# EAGLE design Open_IR_Blaster (EAGLE 9.7.0)
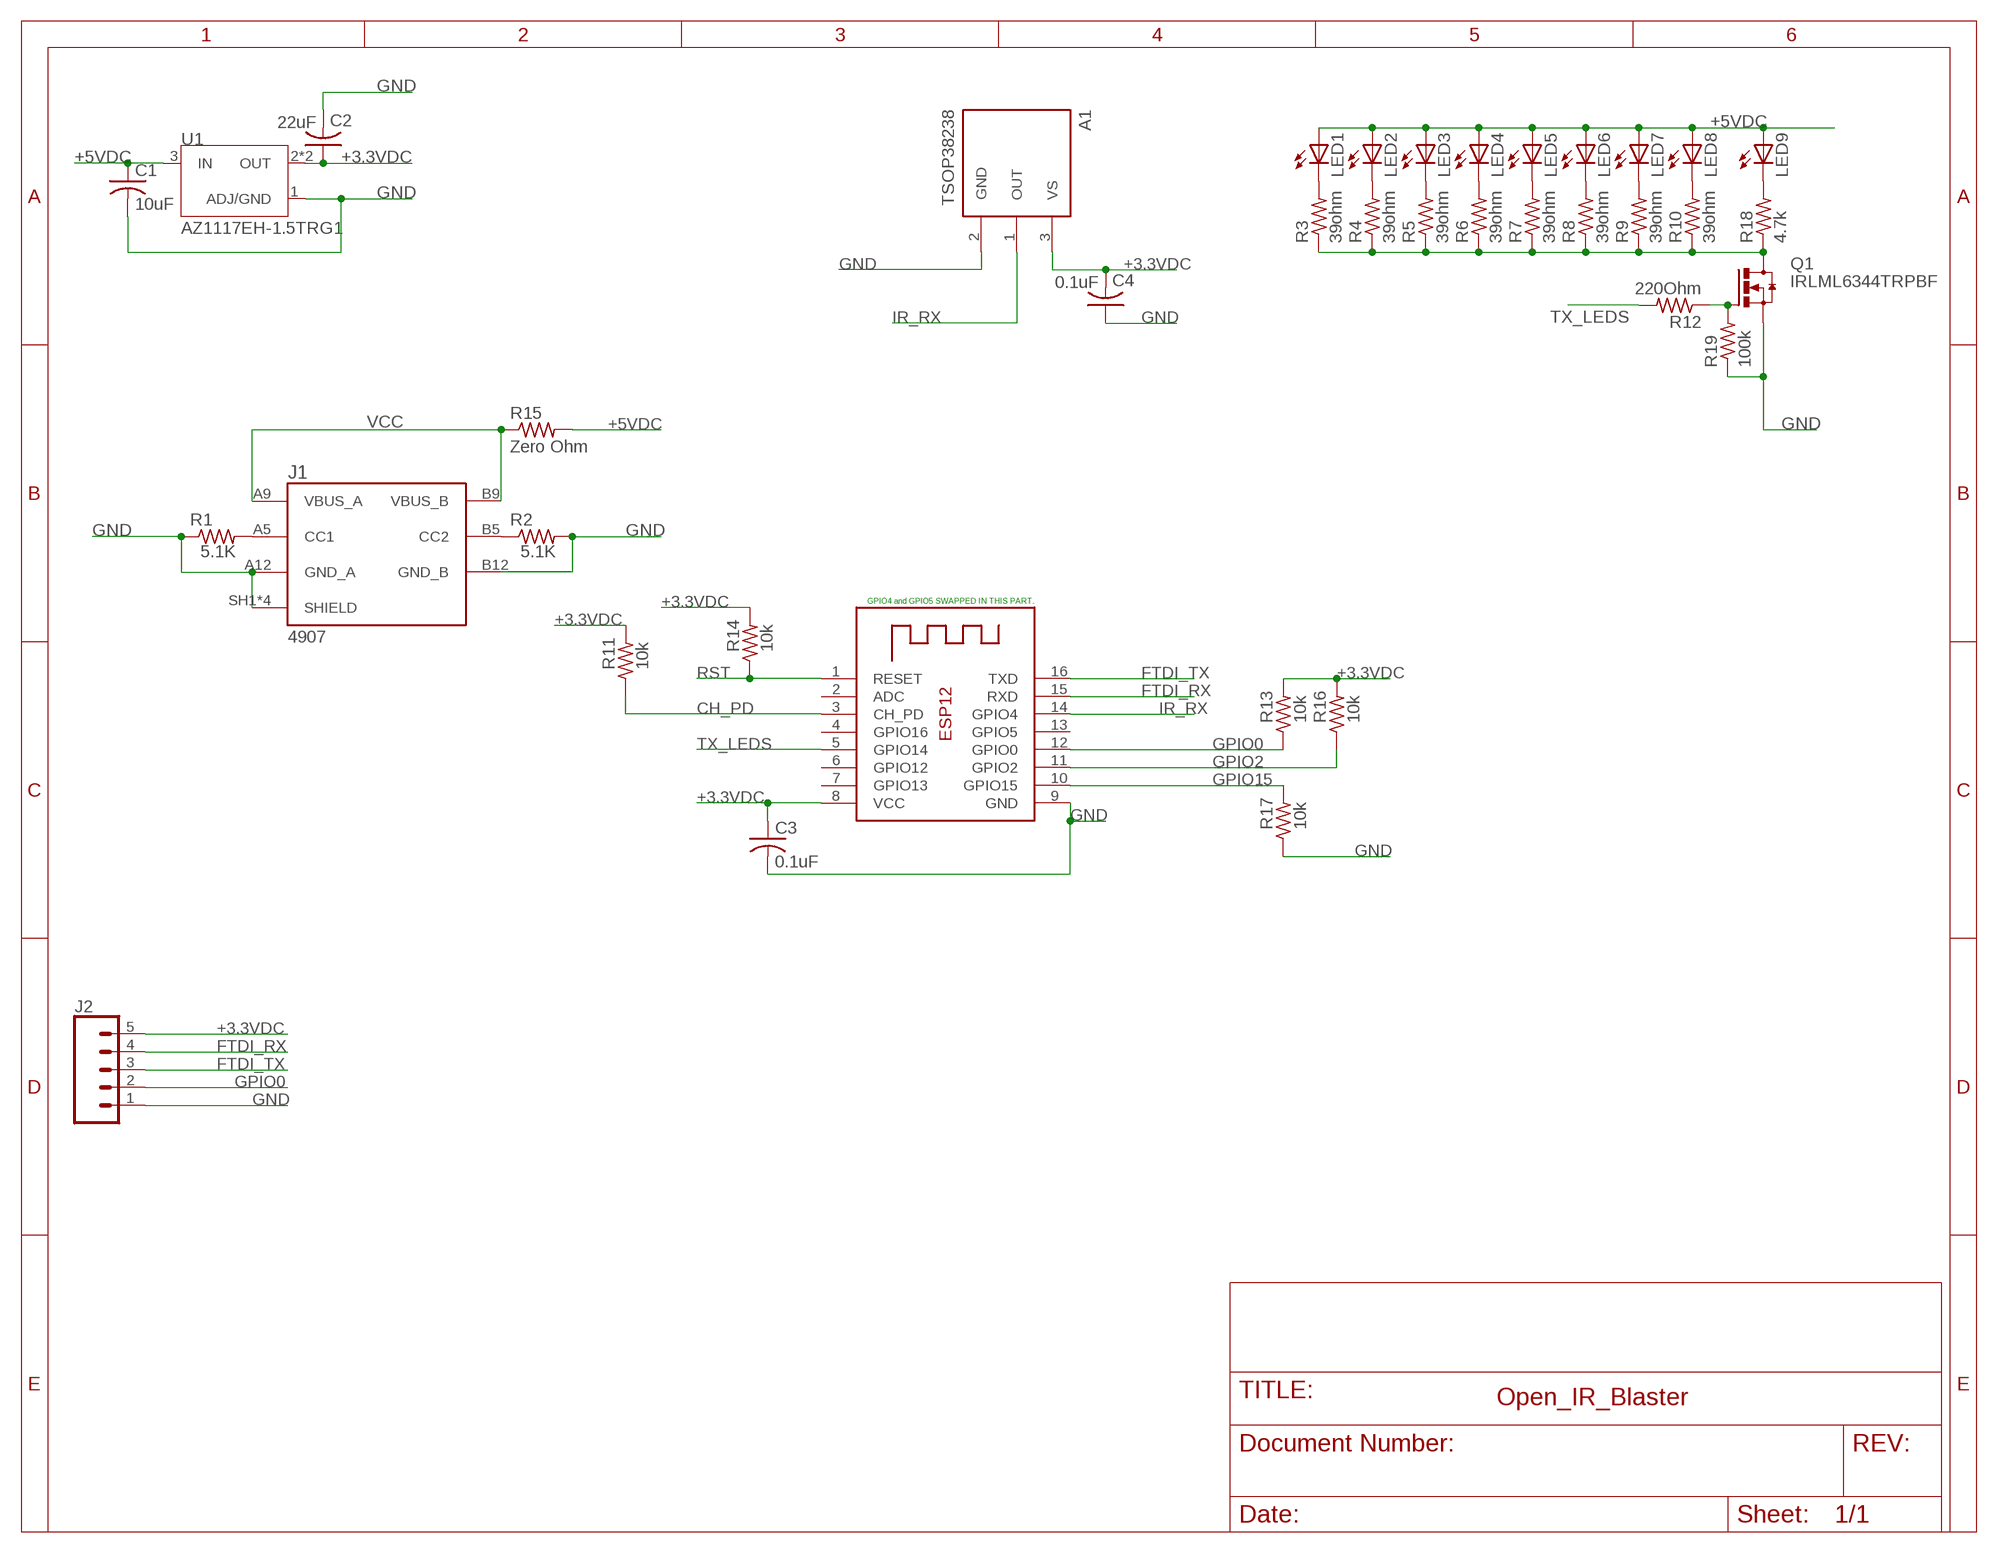
[diagram p0: schematic, sheet 1]

## Parts
A1  TSOP38238  [XDCR_TSOP38238]
C1  10uF  C-USC0805  [C0805]
C2  22uF  C-USC0805  [C0805]
C3  0.1uF  C-USC0805  [C0805]
C4  0.1uF  C-USC0805  [C0805]
J1  4907  [ADAFRUIT_4907]
J2  CONN_05PTH_LONGPADS  [1X05_LONGPADS]
LED1  LED5MM  [LED5MM]
LED2  LED5MM  [LED5MM]
LED3  LED5MM  [LED5MM]
LED4  LED5MM  [LED5MM]
LED5  LED5MM  [LED5MM]
LED6  LED5MM  [LED5MM]
LED7  LED5MM  [LED5MM]
LED8  LED5MM  [LED5MM]
LED9  LEDCHIP-LED0603  [CHIP-LED0603]
Q1  IRLML6344TRPBF  [SOT23]
R1  5.1K  R-US_M0805  [M0805]
R2  5.1K  R-US_M0805  [M0805]
R3  39ohm  R-US_R1210  [R1210]
R4  39ohm  R-US_R1210  [R1210]
R5  39ohm  R-US_R1210  [R1210]
R6  39ohm  R-US_R1210  [R1210]
R7  39ohm  R-US_R1210  [R1210]
R8  39ohm  R-US_R1210  [R1210]
R9  39ohm  R-US_R1210  [R1210]
R10  39ohm  R-US_R1210  [R1210]
R11  10k  R-US_M0805  [M0805]
R12  220Ohm  R-US_M0805  [M0805]
R13  10k  R-US_M0805  [M0805]
R14  10k  R-US_M0805  [M0805]
R15  Zero Ohm  R-US_R1210  [R1210]
R16  10k  R-US_M0805  [M0805]
R17  10k  R-US_M0805  [M0805]
R18  4.7k  R-US_R0603  [R0603]
R19  100k  R-US_R0603  [R0603]
U1  AZ1117EH-1.5TRG1  [SOT230P700X180-4N]
X1  ESP-12  [ESP-12]

## Nets
+3.3VDC: A1.3(VS) C2.1 C3.1 C4.2 J2.5 R11.2 R13.2 R14.2 R16.2 U1.2(OUT) U1.4(OUT) X1.8(VCC)
+5VDC: C1.1 LED1.A LED2.A LED3.A LED4.A LED5.A LED6.A LED7.A LED8.A LED9.A R15.2 U1.3(IN)
CH_PD: R11.1 X1.3(CH_PD)
FTDI_RX: J2.4 X1.15(RXD)
FTDI_TX: J2.3 X1.16(TXD)
GND: A1.2(GND) C1.2 C2.2 C3.2 C4.1 J1.A12(GND_A) J1.B12(GND_B) J1.SH1(SHIELD) J1.SH2(SHIELD) J1.SH3(SHIELD) J1.SH4(SHIELD) J2.1 Q1.2(S) R1.1 R2.2 R17.1 R19.1 U1.1(ADJ/GND) X1.9(GND)
GPIO0: J2.2 R13.1 X1.12(GPIO0)
GPIO2: R16.1 X1.11(GPIO2)
GPIO15: R17.2 X1.10(GPIO15)
IR_RX: A1.1(OUT) X1.14(GPIO4)
N$1: LED1.K(C) R3.2
N$2: LED2.K(C) R4.2
N$3: LED3.K(C) R5.2
N$4: LED4.K(C) R6.2
N$5: LED5.K(C) R7.2
N$6: LED6.K(C) R8.2
N$7: LED7.K(C) R9.2
N$8: LED8.K(C) R10.2
N$9: Q1.3(D) R3.1 R4.1 R5.1 R6.1 R7.1 R8.1 R9.1 R10.1 R18.1
N$10: J1.A5(CC1) R1.2
N$11: J1.B5(CC2) R2.1
N$12: Q1.1(G) R12.1 R19.2
N$13: LED9.C R18.2
RST: R14.1 X1.1(RESET)
TX_LEDS: R12.2 X1.5(GPIO14)
VCC: J1.A9(VBUS_A) J1.B9(VBUS_B) R15.1
Unconnected: X1.2(ADC) X1.4(GPIO16) X1.6(GPIO12) X1.7(GPIO13) X1.13(GPIO5)

## Notes on the sheet
- GPIO4 and GPIO5 SWAPPED IN THIS PART.

## Library data of the parts
A1 = TSOP38238:TSOP38238: Remote Receiver Sensor, 38.0kHz 45m; CHECK_PRICES: https://www.snapeda.com/parts/TSOP38238/Vishay+Semiconductor+Opto+Division/view-part/?ref=eda; DESCRIPTION: Remote Receiver Sensor 38.0kHz 45m Through Hole; DIGIKEY_PART_NUMBER: 751-1227-ND; MF: Vishay; MP: TSOP38238; PACKAGE: None; SNAPEDA_LINK: https://www.snapeda.com/parts/TSOP38238/Vishay+Semiconductor+Opto+Division/view-part/?ref=snap
C1-C4 = adafruit:C-US: CAPACITOR, American symbol
J1 = 4907:4907: Check availability <https://pricing.snapeda.com/parts/4907/Adafruit%20Industries%20LLC/view-part?ref=eda>; AVAILABILITY: Not in stock; CHECK_PRICES: https://www.snapeda.com/parts/4907/Adafruit+Industries/view-part/?ref=eda; DESCRIPTION: USB Connectors USB C SMT / THM Jack Connector - Power Only - Pack of 10; MF: Adafruit Industries LLC; MP: 4907; PACKAGE: NON-STANDARD-64 ADAFRUIT; PRICE: None; SNAPEDA_LINK: https://www.snapeda.com/parts/4907/Adafruit+Industries/view-part/?ref=snap
J2 = SparkFun-Connectors:CONN_05: Multi connection point. Often used as Generic Header-pin footprint for 0.1 inch spaced/style header connections On any of the 0.1 inch spaced packages, you can populate with these: Break Away Headers - Straight <https://www.sparkfun.com/products/116> (PRT-00116) Break Away Male Headers - Right Angle <https://www.sparkfun.com/products/553> (PRT-00553) Female Headers <https://www.sparkfun.com/products/115> (PRT-00115) Break Away Headers - Machine Pin <https://www.sparkfun.com/products/117> (PRT-00117) Break Away Female Headers - Swiss Machine Pin <https://www.sparkfun.com/products/743> (PRT-00743) For SCREWTERMINALS and SPRING TERMINALS visit here: Screw Terimnals on SparkFun.com <https://www.sparkfun.com/search/results?term=Screw+Terminals> (5mm/3.5mm/2.54mm spacing) This device is also useful as a general connection point to wire up your design to another part of your project. Our various solder wires solder well into these plated through hole pads. Hook-Up Wire - Assortment (Stranded, 22 AWG) <https://www.sparkfun.com/products/11375> (PRT-11375) Hook-Up Wire - Assortment (Solid Core, 22 AWG) <https://www.sparkfun.com/products/11367> (PRT-11367) View the entire wire category on our website here <https://www.sparkfun.com/categories/141> Special notes: Molex polarized connector foot print use with SKU : PRT-08231 with associated crimp pins and housings. 1MM SMD Version SKU: PRT-10208
LED1-LED9 = adafruit:LED: LED OSRAM: - CHIPLED LG R971, LG N971, LY N971, LG Q971, LY Q971, LO R971, LY R971 LH N974, LH R974 LS Q976, LO Q976, LY Q976 LO Q996 - Hyper CHIPLED LW Q18S LB Q993, LB Q99A, LB R99A - SideLED LS A670, LO A670, LY A670, LG A670, LP A670 LB A673, LV A673, LT A673, LW A673 LH A674 LY A675 LS A676, LA A676, LO A676, LY A676, LW A676 LS A679, LY A679, LG A679 - Hyper Micro SIDELED® LS Y876, LA Y876, LO Y876, LY Y876 LT Y87S - SmartLED LW L88C, LW L88S LB L89C, LB L89S, LG L890 LS L89K, LO L89K, LY L89K LS L896, LA L896, LO L896, LY L896 - TOPLED LS T670, LO T670, LY T670, LG T670, LP T670 LSG T670, LSP T670, LSY T670, LOP T670, LYG T670 LG T671, LOG T671, LSG T671 LB T673, LV T673, LT T673, LW T673 LH T674 LS T676, LA T676, LO T676, LY T676, LB T676, LH T676, LSB T676, LW T676 LB T67C, LV T67C, LT T67C, LS T67K, LO T67K, LY T67K, LW E67C LS E67B, LA E67B, LO E67B, LY E67B, LB E67C, LV E67C, LT E67C LW T67C LS T679, LY T679, LG T679 LS T770, LO T770, LY T770, LG T770, LP T770 LB T773, LV T773, LT T773, LW T773 LH T774 LS E675, LA E675, LY E675, LS T675 LS T776, LA T776, LO T776, LY T776, LB T776 LHGB T686 LT T68C, LB T68C - Hyper Mini TOPLED® LB M676 - Mini TOPLED Santana® LG M470 LS M47K, LO M47K, LY M47K Source: http://www.osram.convergy.de/
Q1 = IRLML6344TRPBF:IRLML6344TRPBF: Transistor NMOS 30V 6.3A, 29mOhm@4.5V; CHECK_PRICES: https://www.snapeda.com/parts/IRLML6344TRPBF/Infineon/view-part/?ref=eda; DESCRIPTION: IRLML6344TRPBF N-channel MOSFET Transistor, 5 A, 30 V, 3-Pin SOT-23 | Infineon IRLML6344TRPBF; DIGIKEY_PART_NUMBER: IRLML6344TRPBFTR-ND; MF: Infineon Technologies; MP: IRLML6344TRPBF; PACKAGE: SOT-23-3 ON Semiconductor; SNAPEDA_LINK: https://www.snapeda.com/parts/IRLML6344TRPBF/Infineon/view-part/?ref=snap
R1-R19 = adafruit:R-US_: RESISTOR, American symbol
U1 = AZ1117EH-1.5TRG1:AZ1117EH-1.5TRG1: Ldo.Vreg Pos 3, 3v 1a Sot223 Check availability <https://pricing.snapeda.com/parts/AZ1117EH-1.5TRG1/Diodes%20Inc./view-part?ref=eda>; AVAILABILITY: In Stock; CHECK_PRICES: https://www.snapeda.com/parts/AZ1117EH-1.5TRG1/Diodes+Inc./view-part/?ref=eda; DESCRIPTION: Linear Voltage Regulator IC Positive Fixed 1 Output 1A SOT-223-3; MF: Diodes Inc.; MP: AZ1117EH-1.5TRG1; PACKAGE: SOT-223 Diodes Inc.; PRICE: None; SNAPEDA_LINK: https://www.snapeda.com/parts/AZ1117EH-1.5TRG1/Diodes+Inc./view-part/?ref=snap
X1 = adafruit:ESP-12

## Board
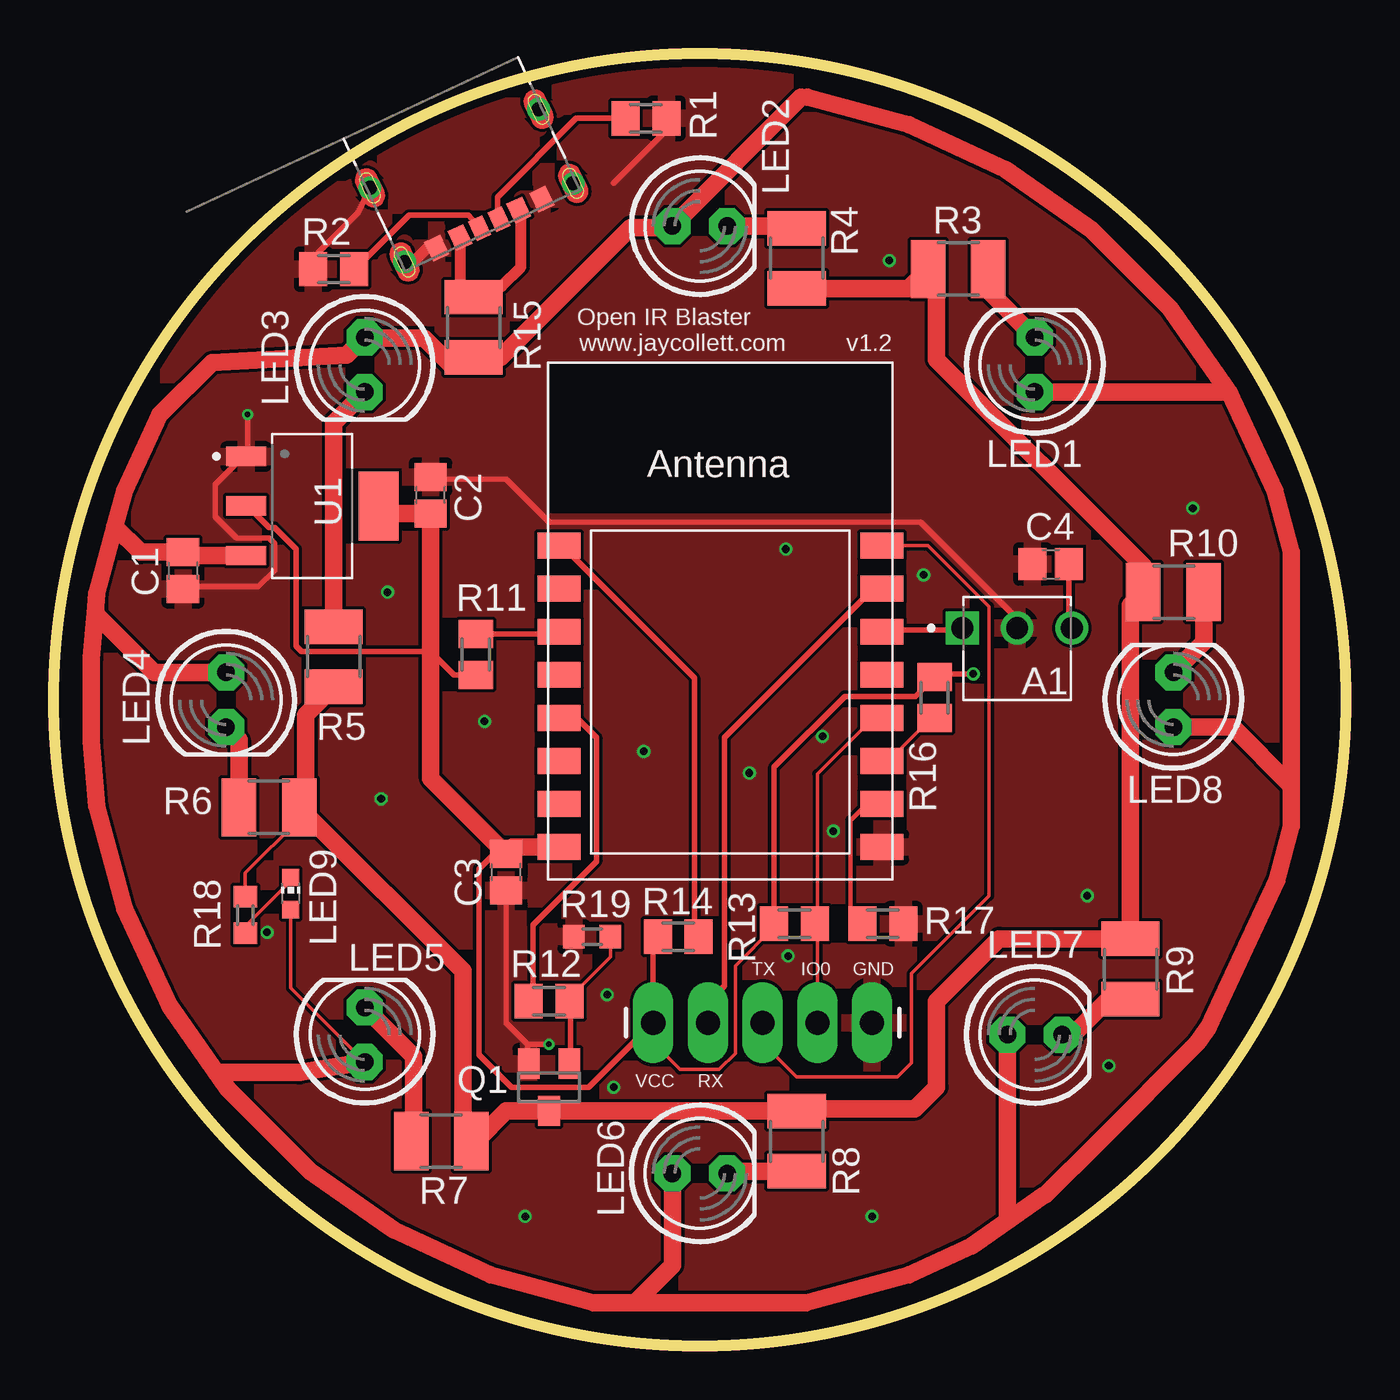
[diagram p1: board, top side]
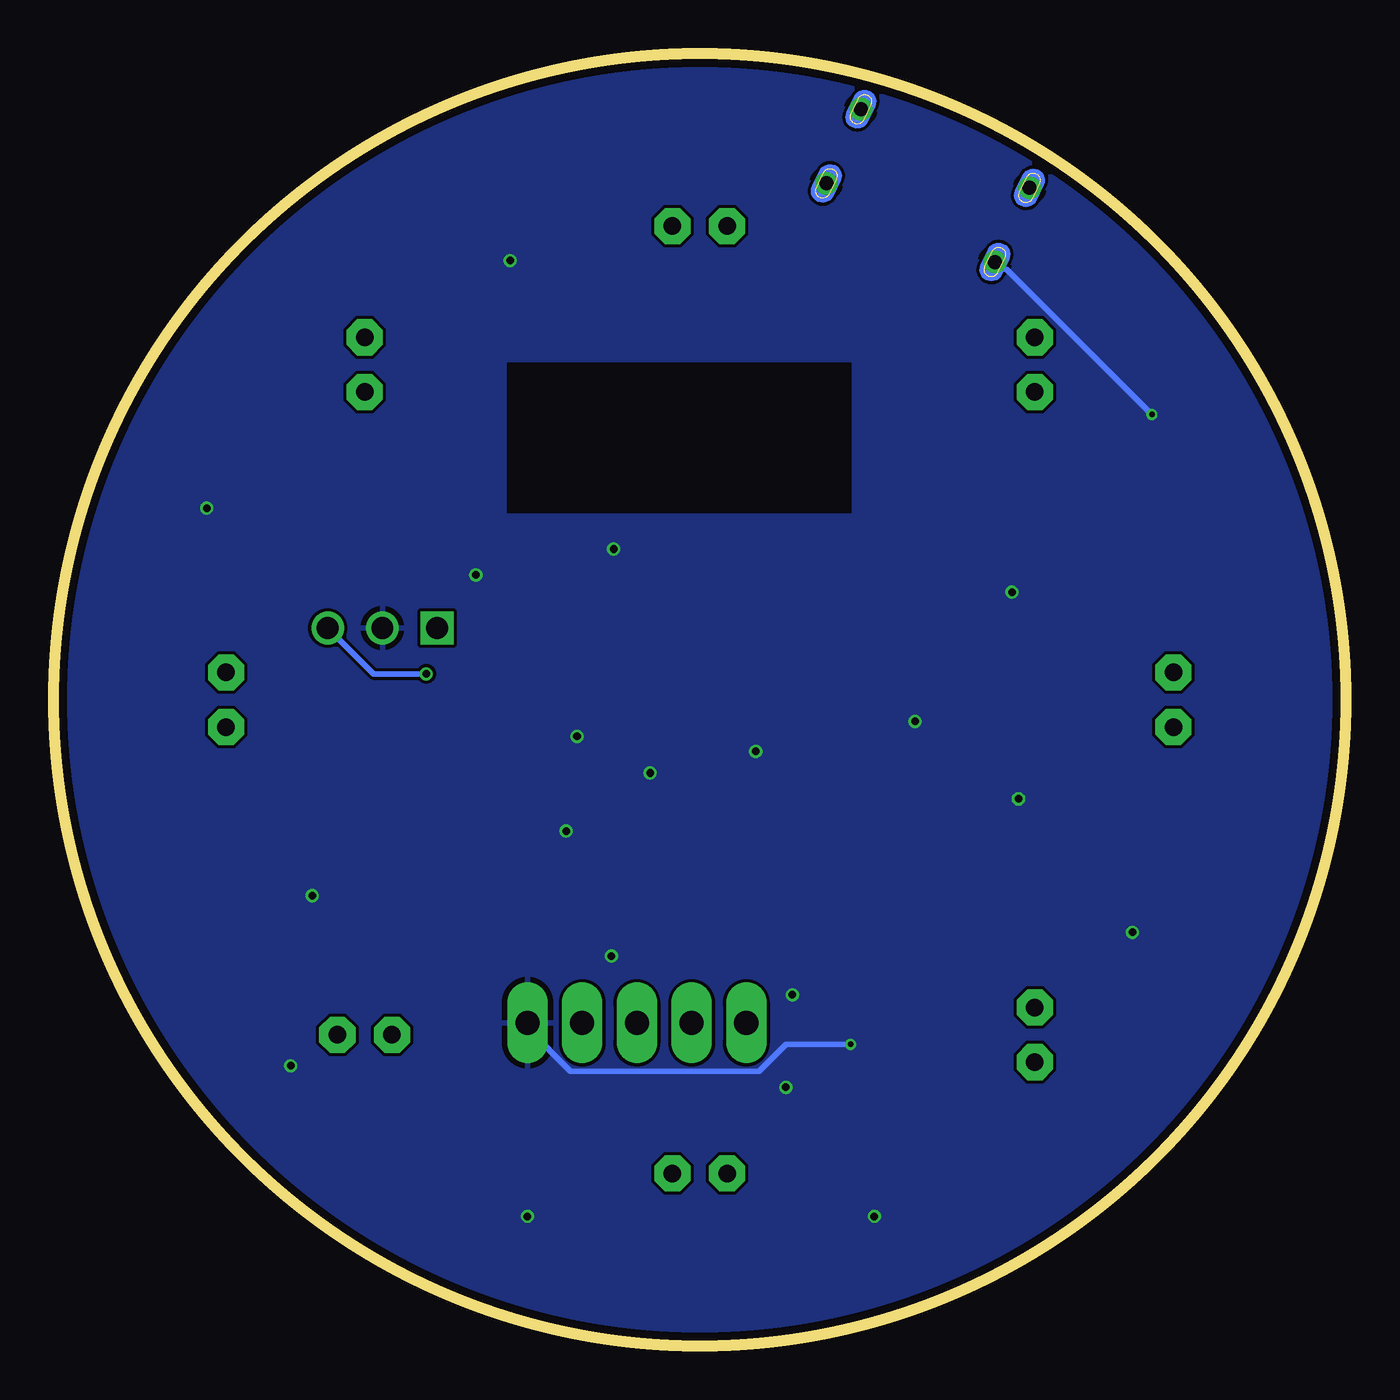
[diagram p2: board, bottom side, seen from below]

Size 60 x 60 mm. Coordinates in mm from the lower left corner, seen from the top.
Outline: circle at 30,30 radius 30
Copper layers (1*16): Top 0.035559375mm / dielectric 1.6mm / Bottom 0.035559375mm
Design rules "oshpark-2layer *": minimum track width 6mil, minimum drill 10mil, track to track 6mil, track to pad 6mil, pad to pad 6mil, via to via 6mil, smd to smd 6mil, copper to edge 15mil, drill to drill 6mil, minimum pad ring 5mil, minimum via ring 5mil, stop-mask expansion 2.5mil, vias tented up to drill 30mil, thermal gap 10mil

### Footprints (pad centres in the part's own frame; a part is rotated, then mirrored left to right if it is on the bottom)
XDCR_TSOP38238 = drill 1.01 square: 1 -2.54,0 | drill 1.01: 2 0,0; 3 2.54,0
C0805 = smd 1.3 x 1.5: 1 -0.85,0; 2 0.85,0
ADAFRUIT_4907 = smd 0.7 x 1: A5 -0.5,3.85; B5 0.5,3.85 | smd 0.8 x 1: A9 1.5,3.85; A12 2.7,3.85; B9 -1.5,3.85; B12 -2.7,3.85 | drill 0.65 pad 1.05: SH1 -4.32,3.8; SH2 4.32,3.8; SH3 -4.32,0; SH4 4.32,0
1X05_LONGPADS = drill 1.118 pad 1.88 long: 1 0,0; 2 2.54,0; 3 5.08,0; 4 7.62,0; 5 10.16,0
LED5MM = drill 0.813 pad 1.676 octagon: A -1.27,0; K 1.27,0
CHIP-LED0603 = smd 0.8 x 0.8: A 0,-0.75; C 0,0.75
SOT23 = smd 1 x 1.4: 1 -0.95,-1.1; 2 0.95,-1.1; 3 0,1.1
M0805 = smd 1.3 x 1.6: 1 -0.95,0; 2 0.95,0
R1210 = smd 1.6 x 2.7: 1 -1.4,0; 2 1.4,0
R0603 = smd 1 x 1.1: 1 -0.85,0; 2 0.85,0
SOT230P700X180-4N = smd 1.86 x 0.9: 1 -3.075,2.3; 2 -3.075,0; 3 -3.075,-2.3 | smd 1.86 x 3.19: 4 3.075,0
ESP-12 = smd 2 x 1.2: 1 -7.5,4.5; 2 -7.5,2.5; 3 -7.5,0.5; 4 -7.5,-1.5; 5 -7.5,-3.5; 6 -7.5,-5.5; 7 -7.5,-7.5; 8 -7.5,-9.5; 9 7.5,-9.5; 10 7.5,-7.5; 11 7.5,-5.5; 12 7.5,-3.5; 13 7.5,-1.5; 14 7.5,0.5; 15 7.5,2.5; 16 7.5,4.5

### Placement (x,y rotation side)
A1  44.74,33.33 0 top
C1  6,36 270 top
C2  17.5,39.5 90 top
C3  21,22 270 top
C4  46.3,36.3 0 top
J1  18.6,55.6 205 top
J2  38,15 180 top
LED1  45.56,45.56 90 top
LED2  30,52 0 top
LED3  14.44,45.56 270 top
LED4  8,30 270 top
LED5  14.44,14.44 90 top
LED6  30,8 0 top
LED7  45.56,14.44 0 top
LED8  52,30 90 top
LED9  11,21 0 top
Q1  23,12 180 top
R1  27.5,57 180 top
R2  13,50 180 top
R3  42,50 0 top
R4  34.5,50.5 90 top
R5  13,32 90 top
R6  10,25 180 top
R7  18,9.5 180 top
R8  34.5,9.5 270 top
R9  50,17.5 270 top
R10  52,35 0 top
R11  19.6,32.1 270 top
R12  23,16 180 top
R13  34.4,19.6 180 top
R14  29,19 180 top
R15  19.5,47.3 270 top
R16  40.9,30.1 90 top
R17  38.5,19.6 180 top
R18  8.9,20 270 top
R19  25,19 0 top
U1  12,39 0 top
X1  30.96,32.66 0 top

### Tracks (layer width: path | path; a pad name or v marks a point on that pad's centre or on a via)
+3.3VDC  (via drill 0.35)
  Top 0.152: R13.2 33.45,19.45 31.65,17.65 31.65,13.58 30.9,12.82 29.08,12.82 27.84,14.06 J2.5
  Top 0.254: R11.2 18.6,31.15 17.5,32.25 11.5,32.25 11.25,32.5 11.25,37 10.25,38 10,38 9,39 U1.2 | C4.2 47.15,33.46 A1.3 | v42.7,31.2 41.05,31.2 R16.2 40.01,30.16 36.74,30.16 33.45,26.87 R13.2 | C3.1 20.58,22.98 19.75,22.15 19.75,13.5 21.25,12 24.84,12 J2.5 27.84,18.79 R14.2
  Top 0.813: X1.8 21.31,23.16 C3.1 17.5,26.35 17.5,32.25 C2.1 15.43,38.65 U1.4
  Bottom 0.254: A1.3 45.15,31.2 v42.7,31.2
+5VDC
  Top 0.152: LED9.A 11,16.61 LED5.A
  Top 0.508: 18.4,45.6 18.7,45.9 R15.2 20.76,45.9
  Top 0.61: 28.3,51.94 28.36,52 LED2.A | 34.71,57.98 34.99,57.98 | 34.94,2 34.91,2 | 25.09,2 25.06,2 | 46.05,7 46,7 | 54.55,44.29 54.62,44.22 | 6.15,36.7 C1.1
  Top 0.813: LED2.A 34.71,57.98 | 34.99,57.98 39.72,56.72 44.22,54.62 48.19,51.84 51.84,48.19 54.62,44.22 56.72,39.72 57.48,36.86 57.48,26 | 57.48,26 57.48,24.14 56.81,21.62 53.62,14.79 53.11,14.06 48.53,9.47 46.05,7 | 46,7 44.19,5.73 | 44.19,5.73 42.63,4.64 39.72,3.29 34.94,2 | 25.06,2 20.28,3.29 15.79,5.38 11.9,8.1 8.1,11.9 7.55,12.68 | 7.55,12.68 5.38,15.79 3.29,20.28 2,25.06 1.74,28.07 1.74,31.93 1.92,34.01 | 1.92,34.01 2,34.94 2.84,38.04 | 2.84,38.04 3.29,39.72 4.92,43.23 7.34,45.66 13.61,46 LED3.A 14.47,46.8 17.2,46.8 18.4,45.6 | 34.91,2 27,2 | 27,2 25.09,2 | 2.84,38.04 4.03,36.85 C1.1 | LED4.A 4.66,31.27 1.92,34.01 | LED5.A 11.41,12.68 7.55,12.68 | LED6.A 28.73,3.73 27,2 | LED8.A 54.75,28.73 57.48,26 | LED1.A 54.55,44.29 | U1.3 6.15,36.7 | 44.19,5.73 44.29,5.83 LED7.A | 28.3,51.94 26.8,51.94 20.76,45.9
CH_PD
  Top 0.254: R11.1 23.35,33.05 X1.3
FTDI_RX
  Top 0.254: X1.15 38.06,35.16 31.14,28.24 31.14,16.7 30.38,15.94 J2.4
FTDI_TX
  Top 0.152: X1.16 40.61,37.16 43.43,34.34 43.43,20.89 39.83,17.29 39.83,13.14 39.17,12.48 34.5,12.48 32.92,14.06 J2.3
GND  (via drill 0.25, 0.35)
  Top 0.254: C1.2 6,35.25 9.5,35.25 10.25,36 10.25,37.25 10,37.5 8.5,37.5 7.5,38.5 7.5,40 8.75,41.25 U1.1 9,41.5 v9,43.25 | 22,14 22,13.25 Q1.2 | 22,14 21,15 C3.2 | C2.2 17.5,40.25 21,40.25 23,38.25 40.25,38.25 44.5,34 44.5,33.5 A1.2 | R2.2 12.25,50 12.25,50.75 14.13,52.63 J1.SH4 | 26,54 28.25,56.25 28.25,56.5 28.45,56.7 R1.1 | v23,14 22,14
  Top 0.508: J1.A12 17.33,50.97 16.69,50.33 J1.SH2
  Bottom 0.254: v23,14 26,14 27.25,12.75 36,12.75 38,14.75 J2.1 | v9,43.25 15.75,50 16.02,50 J1.SH2
  other vias: 38.8,50.4 52.9,38.9 27.4,27.6 34,37 38,6 49,13 15.5,35 15.2,25.4 26,12 35.7,28.3 36.2,23.9 20,29 32.3,26.6 48,20.9 9.9,19.2 21.9,6 25.7,16.3 34.1,18.1 40.4,35.8
  pour Bottom: -2,-3 66,-3 66,62 -2,62
  pour Top: -8,-7 72,-7 72,68 -8,68
GPIO0
  Top 0.152: R13.1 35.46,19.49 35.46,15.94 | 35.46,15.94 J2.2 35.46,15.94 | X1.12 38.06,29.16 35.46,26.56 35.46,15.94
GPIO2
  Top 0.152: X1.11 38.76,27.16 40.75,29.15 R16.1
GPIO15
  Top 0.203: X1.10 38.3,25 37.6,25 37,24.4 37,20.25 37.55,19.7 R17.2
IR_RX
  Top 0.254: X1.14 38.5,33.25 42,33.25 A1.1
N$1
  Top 0.61: 43.4,48.99 R3.2
  Top 0.813: LED1.K 43.4,48.99
N$2
  Top 0.61: 34.4,52 R4.2
  Top 0.813: LED2.K 34.4,52
N$3
  Top 0.813: LED3.K 13,42.85 R5.2
N$4
  Top 0.813: LED4.K 8.6,28.13 R6.2
N$5
  Top 0.813: LED5.K 16.71,13.44 16.71,9.61 R7.2
N$6
  Top 0.61: LED6.K 31.37,8.1
  Top 0.813: 31.37,8.1 R8.2
N$7
  Top 0.813: R9.2 49,16.1 47.34,14.44 LED7.K
N$8
  Top 0.813: R10.2 53.4,32.67 LED8.K
N$9
  Top 0.152: R18.1 8.9,21.95 11.4,24.45 R6.1
  Top 0.61: 50.6,36.2 R10.1 | R8.1 34.6,11
  Top 0.813: R8.1 Q1.3 21,10.9 19.6,9.5 R7.1 19,9.9 19,17.4 11.7,24.7 | 50.6,36.2 41,45.8 41,49.6 R3.1 39.7,49.1 R4.1 | R10.1 50,34.4 R9.1 43.9,18.9 41,16 41,12 40,11 34.6,11 | R5.1 11.7,29.3 11.7,24.7 | 11.7,24.7 R6.1
N$10
  Top 0.254: J1.A5 20.6,52.4 20.6,53.35 24.25,57 R1.2
N$11
  Top 0.254: J1.B5 19.25,52.5 16.5,52.5 14,50 R2.1
N$12
  Top 0.152: R12.1 23.95,16.15 25.85,18.05 R19.2
  Top 0.254: Q1.1 24,13.25 24,16 R12.1
N$13
  Top 0.152: R18.2 8.9,19.48 11,21.58 LED9.C
RST
  Top 0.254: R14.1 29.75,19 29.75,31 23.5,37.25 X1.1
TX_LEDS
  Top 0.254: R12.2 22.25,16 22.25,19.55 25.2,22.5 25.2,28.25 24.29,29.16 X1.5
VCC
  Top 0.254: R15.1 20,49.2 20.8,49.2
  Top 0.508: J1.A9 18.87,49.28 19.77,48.38 19.77,49 19.5,48.73 R15.1 | J1.B9 21.59,52.51 21.7,52.4 21.7,50.1 20.8,49.2

### Text on the board
tPlace: Open IR Blaster | www.jaycollett.com | v1.2
tNames: TX | IO0 | GND | VCC | RX